# EAGLE schematic Volterra Extruder_0 Board (EAGLE 9.1.3)
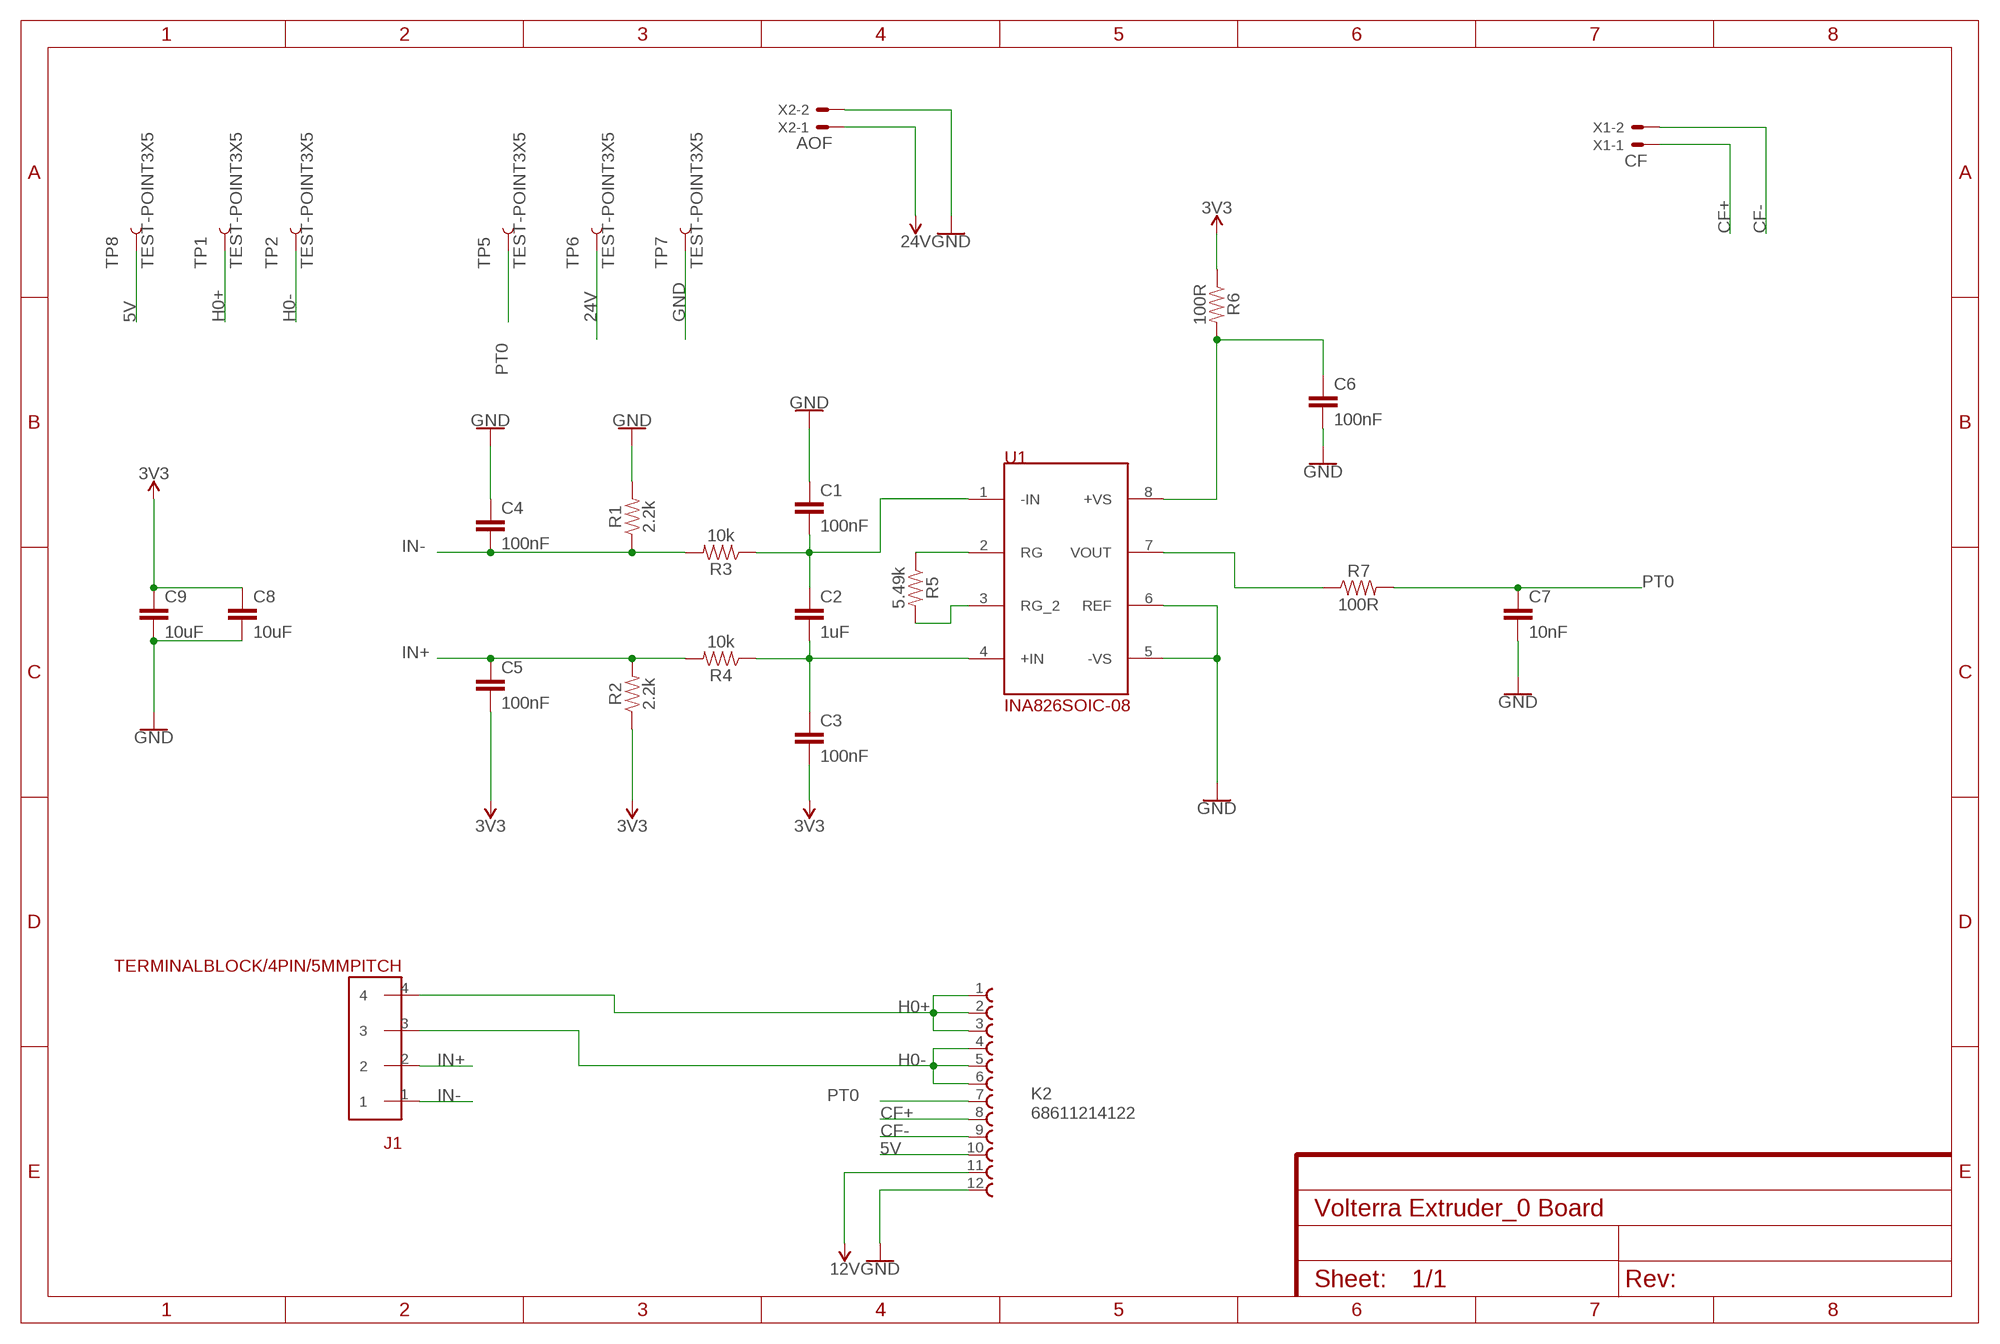
[diagram p0: schematic, sheet 1]

## Parts
C1  100nF  0.1UF-0603-25V-(+80/-20%)  [0603]
C2  1uF  0.1UF-0603-25V-(+80/-20%)  [0603]
C3  100nF  0.1UF-0603-25V-(+80/-20%)  [0603]
C4  100nF  0.1UF-0603-25V-(+80/-20%)  [0603]
C5  100nF  0.1UF-0603-25V-(+80/-20%)  [0603]
C6  100nF  0.1UF-0603-25V-(+80/-20%)  [0603]
C7  10nF  0.1UF-0603-25V-(+80/-20%)  [0603]
C8  10uF  0.1UF-0603-25V-(+80/-20%)  [0603]
C9  10uF  0.1UF-0603-25V-(+80/-20%)  [0603]
J1  TERMINALBLOCK/4PIN/5MMPITCH  [TERMINALBLOCK/TOYO/4PIN/5MMPITCH]
K2  68611214122  [68611214122]
R1  2.2k  1.8KOHM-0603-1/10W-1%  [0603]
R2  2.2k  1.8KOHM-0603-1/10W-1%  [0603]
R3  10k  1.8KOHM-0603-1/10W-1%  [0603]
R4  10k  1.8KOHM-0603-1/10W-1%  [0603]
R5  5.49k  1.8KOHM-0603-1/10W-1%  [0603]
R6  100R  1.8KOHM-0603-1/10W-1%  [0603]
R7  100R  1.8KOHM-0603-1/10W-1%  [0603]
TP1  TEST-POINT3X5  [PAD.03X.05]
TP2  TEST-POINT3X5  [PAD.03X.05]
TP5  TEST-POINT3X5  [PAD.03X.05]
TP6  TEST-POINT3X5  [PAD.03X.05]
TP7  TEST-POINT3X5  [PAD.03X.05]
TP8  TEST-POINT3X5  [PAD.03X.05]
U1  INA826SOIC-08  [SOIC-8]
X1  CF  JST-XH-02-PIN-LONG-PAD  [JST-XH-02-PACKAGE-LONG-PAD]
X2  AOF  JST-XH-02-PIN-LONG-PAD  [JST-XH-02-PACKAGE-LONG-PAD]

## Nets
5V: C3.2 C5.2 C8.1 C9.1 K2.10 R2.1 R6.1 TP8.P$1 ; supply symbol labelled 3V3
24V: K2.11 TP6.P$1 X2.1 ; supply symbol labelled 12V
CF+: K2.8 X1.1
CF-: K2.9 X1.2
GND: C1.1 C4.1 C6.2 C7.2 C8.2 C9.2 K2.12 R1.2 TP7.P$1 U1.5(-VS) U1.6(REF) X2.2
H0+: J1.4 K2.1 K2.2 K2.3 TP1.P$1
H0-: J1.3 K2.4 K2.5 K2.6 TP2.P$1
IN+: C5.1 J1.2 R2.2 R4.2
IN-: C4.2 J1.1 R1.1 R3.2
N$1: R5.1 U1.2(RG)
N$2: R5.2 U1.3(RG_2)
N$3: C1.2 C2.1 R3.1 U1.1(-IN)
N$4: C2.2 C3.1 R4.1 U1.4(+IN)
N$5: C6.1 R6.2 U1.8(+VS)
N$8: R7.1 U1.7(VOUT)
PT0: C7.1 K2.7 R7.2 TP5.P$1

## Library data of the parts
C1-C9 = SparkFun-Capacitors:0.1UF: 0.1µF ceramic capacitors A capacitor is a passive two-terminal electrical component used to store electrical energy temporarily in an electric field.; PROD_ID: CAP-00810; VALUE: 0.1uF
J1 = FracktalWorks_Eagle_Library:TERMINALBLOCK/4PIN/5MMPITCH
K2 = Wurth_Elektronik_Electromechanic_FPC_Connectors_&_Flat_Flexible_Cable_rev15b:68611214122: WR-FPC 1.00mm SMT ZIF Horizontal Top Contact, 12 Pins=>Code : Con_FPC_ZIF_1.00_68611214122 <http://katalog.we-online.de/media/images/eican/Con_FPC_ZIF_1.00_6861xx14122_pf2.jpg> Details see: http://katalog.we-online.de/en/em/686_1xx_141_22 Created 2014-07-09, Karrer Zheng 2014 (C) Würth Elektronik
R1-R7 = SparkFun-Resistors:1.8KOHM: 1.8kΩ resistor A resistor is a passive two-terminal electrical component that implements electrical resistance as a circuit element. Resistors act to reduce current flow, and, at the same time, act to lower voltage levels within circuits. - Wikipedia; PROD_ID: RES-09119; VALUE: 1.8k
TP1 TP2 TP5-TP8 = SparkFun-Connectors:TEST-POINT: SparkFun Test Points Bare copper test points for troubleshooting or In-Circuit-Testing. These are used by our Production team for verifying production board runs using pogo-pins on test beds. SparkFun Products: SparkFun LSM9DS1 Breakout <https://www.sparkfun.com/products/13284> SparkFun PSOC <https://www.sparkfun.com/products/13714> SparkFun Load Cell Amplifier <https://www.sparkfun.com/products/13879>
U1 = smd-footprints:INA826
X1 X2 = Rembrandt Electronics - JST XH Connectors v1-0:JST-XH-02-PIN: JST XH Connector 2 Pin Wire to board connector. Pitch: 2,54 mm, (0.100") Number of pins: 2 Created by Rembrandt Electronics www.rembrandtelectronics.com

## Net classes
0 default: width 0.305 mm